# Altium project QCopterMV-CameraExp.PrjPCB
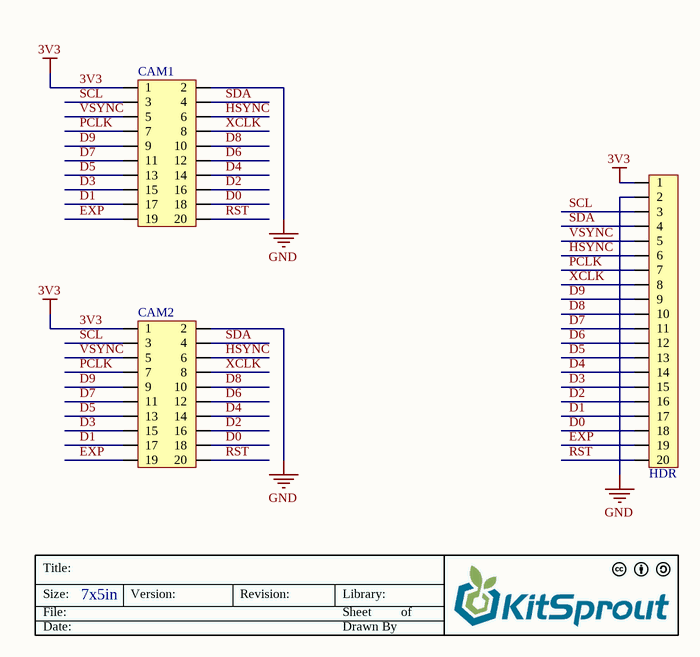
[diagram p0: QCopterMV-CameraExp_Sch.SchDoc]
1 sheet, 3 parts. Net scope: global (net labels, ports and power ports of the same name join across sheets).
Board file: QCopterMV-CameraExp_Pcb.PcbDoc

## Sheet QCopterMV-CameraExp_Sch.SchDoc: Camera-MT
size 254 x 254 mm; Author: Hom; CompanyName: KitSprout; DrawnBy: Hom; Engineer: Hom; Organization: KitSprout; Revision: A; SheetNumber: 1; SheetTotal: 1; Version: 2.0; LibVersion: 1.9; PageSetup: Record=PageOptions|CenterHorizontal=True|CenterVertical=True|PrintScale=1.00|XCorrection=1.00|YCorrection=1.00|PrintKind=0|BorderSize=5000000|LeftOffset=0|BottomOffset=0|Orientation=2|PaperLength=1000|PaperWidth=1000|Scale=100|PaperSource=7|PrintQuality=-3|MediaType=1|DitherType=10|PrintScaleMode=0|PaperKind=A4|PaperIndex=9

### Parts
CAM1  HDR2x10_2.54  [HDR2X10_2.54_180F]  (value not drawn)
CAM2  HDR2x10_2.54  [HDR2X10_2.54_180F]  (value not drawn)
HDR  HDR1x20_1.27  [HDR1X20_1.27_180]  (value not drawn)

### Nets
3V3: CAM1.1 CAM2.1 HDR.1
GND: CAM1.2 CAM2.2 HDR.2
D0: CAM1.18 CAM2.18 HDR.18
D1: CAM1.17 CAM2.17 HDR.17
D2: CAM1.16 CAM2.16 HDR.16
D3: CAM1.15 CAM2.15 HDR.15
D4: CAM1.14 CAM2.14 HDR.14
D5: CAM1.13 CAM2.13 HDR.13
D6: CAM1.12 CAM2.12 HDR.12
D7: CAM1.11 CAM2.11 HDR.11
D8: CAM1.10 CAM2.10 HDR.10
D9: CAM1.9 CAM2.9 HDR.9
EXP: CAM1.19 CAM2.19 HDR.19
HSYNC: CAM1.6 CAM2.6 HDR.6
PCLK: CAM1.7 CAM2.7 HDR.7
RST: CAM1.20 CAM2.20 HDR.20
SCL: CAM1.3 CAM2.3 HDR.3
SDA: CAM1.4 CAM2.4 HDR.4
VSYNC: CAM1.5 CAM2.5 HDR.5
XCLK: CAM1.8 CAM2.8 HDR.8

### Notes on the sheet
- Title:
- Size:
- Date:
- File:
- 7x5in
- Version:
- Revision:
- Sheet
- Drawn By
- Library:
- of

### Library data of the parts
CAM1 CAM2 = HDR2x10_2.54: Header
HDR = HDR1x20_1.27: Header